# Altium schematic sheet zftplk1.SchDoc
size A4; Organization: ATM PP; SheetNumber: 1; SheetTotal: 1; LotOfPieces: 1
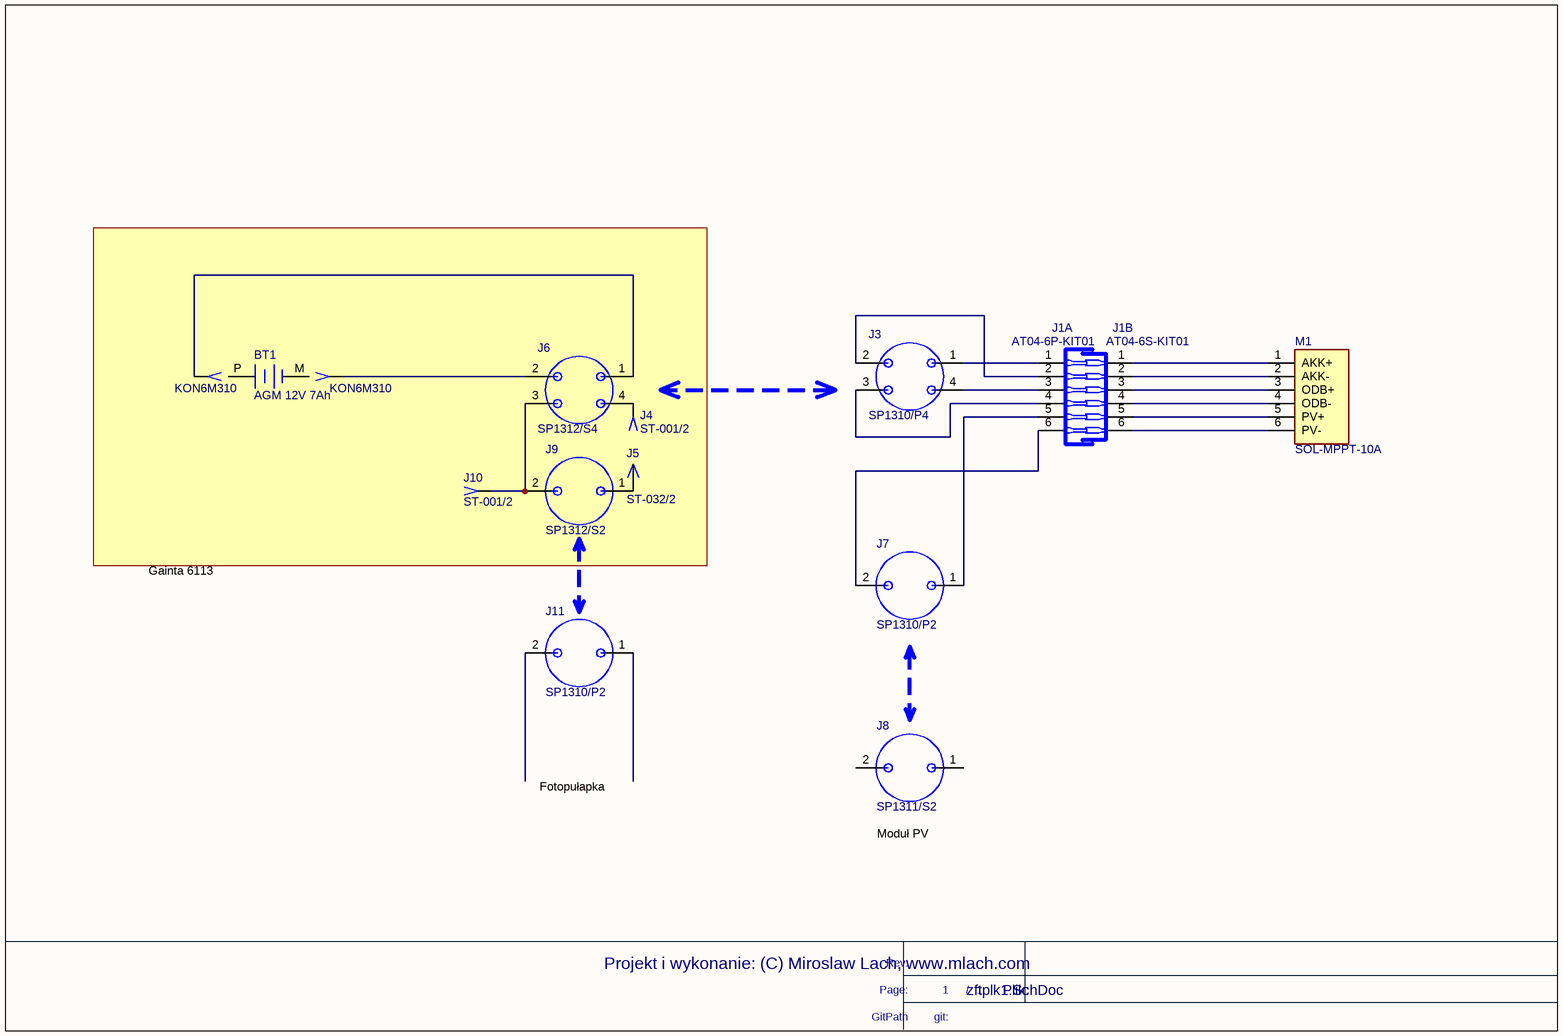
[diagram p0: zftplk1.SchDoc]

## Parts
BT1  AGM 12V 7Ah  [-]
J1  KON6M310
J1A  AT04-6P-KIT01
J1B  AT04-6S-KIT01
J2  KON6M310
J3  SP1310/P4
J4  ST-001/2
J5  ST-032/2
J6  SP1312/S4
J7  SP1310/P2
J8  SP1311/S2
J9  SP1312/S2
J10  ST-001/2
J11  SP1310/P2
M1  SOL-MPPT-10A  [SOL-MPPT-10A]

## Nets
NetJ1_1: J1.1 J6.1
NetJ1A_1: J1A.1 J3.1
NetJ1A_2: J1A.2 J3.2
NetJ1A_3: J1A.3 J3.4
NetJ1A_4: J1A.4 J3.3
NetJ1A_5: J1A.5 J7.1
NetJ1A_6: J1A.6 J7.2
NetJ1B_1: J1B.1 M1.1(AKK+)
NetJ1B_2: J1B.2 M1.2(AKK-)
NetJ1B_3: J1B.3 M1.3(ODB+)
NetJ1B_4: J1B.4 M1.4(ODB-)
NetJ1B_5: J1B.5 M1.5(PV+)
NetJ1B_6: J1B.6 M1.6(PV-)
NetJ2_1: J2.1 J6.2
NetJ4_1: J4.1 J6.4
NetJ5_1: J5.1 J9.1
NetJ6_3: J6.3 J9.2 J10.1

Not connected (* = marked no-connect by the designer): BT1 M(MINU) P(PLUS); J8 1 2; J11 1 2

## Notes on the sheet
- Gainta 6113
- Fotopułapka
- Moduł PV
- Page:
- Rev.
- /
- Projekt i wykonanie: (C) Miroslaw Lach, www.mlach.com
- Plik:
- GitPath
- git:

## Library data of the parts
BT1 = Oth20: Kod: Oth20; ID: 20; Descript: Akumulator Green Cell 12 V 7,2 Ah; Reference: bd; Value: AGM 12V 7Ah; Comm: AGM 12V 7Ah; Price: 55; DateOfPrice: 06-07-2023; Supplier: bd; Manufacturer: bd; Typ: bd
J1 J2 = Con68: Kod: Con68; ID: 68; Descript: Konektor żeński, 6.3 x 0.5 mm, mosiężny, do przewodów 0.5-1.5mm; Replacement: bd; Value: KON6M310; Comm: KON6M310; Price: 0; DateOfPrice: 01-01-2010; Supplier: maritex.com.pl; Reference: KON6M310
J1A = CON350: Manufacturer: Amphenol; Kod: CON350; ID: 350; Descript: Złącze: przewód-przewód; AT; męskie; wtyk; na przewód; PIN: 6; 13A; Replacement: bd; Value: AT04-6P-KIT01; Comm: AT04-6P-KIT01; Price: 21; DateOfPrice: 15-02-2023; Typ: AT04-6P-KIT01; Supplier: TME; Reference: AT04-6P-KIT01
J1B = CON351: Manufacturer: Amphenol; Kod: CON351; ID: 351; Descript: Złącze: przewód-przewód; AT; żeńskie; wtyk; na przewód; PIN: 6; 13A; Replacement: bd; Value: AT04-6S-KIT01; Comm: AT04-6S-KIT01; Price: 36; DateOfPrice: 15-02-2023; Typ: AT04-6S-KIT01; Supplier: TME; Reference: AT04-6S-KIT01
J3 = Con354: Manufacturer: WEIPU; Kod: Con354; ID: 354; Descript: Wtyk; SP13; męskie; PIN: 4; IP68; 4÷6,5mm; 5A; lutowanie; na przewód; Typ: SP1310/P4IN; Replacement: bd; Value: SP1310/P4; Comm: SP1310/P4; Price: 18; DateOfPrice: 06-07-2023; Supplier: tme; Reference: SP1310/P4
J4 J10 = CON353: Manufacturer: Ninigi; Kod: CON353; ID: 353; Descript: Konektor: płaski; 2,8mm; 0,5mm; żeński; 0,5÷1mm2; zaciskanie; Replacement: bd; Value: ST-001/2; Comm: ST-001/2; Price: 0,3; DateOfPrice: 06-07-2023; Typ: ST-001/2; Supplier: tme; Reference: ST-001/2
J5 = CON352: Manufacturer: Ninigi; Kod: CON352; ID: 352; Descript: Konektor: płaski; 2,8mm; 0,8mm; męski; 0,5÷1mm2; zaciskanie; Replacement: bd; Value: ST-032/2; Comm: ST-032/2; Price: 0,3; DateOfPrice: 06-07-2023; Typ: ST-032/2; Supplier: tme; Reference: ST-032/2
J6 = Con355: Manufacturer: WEIPU; Value: SP1312/S3; Kod: Con355; ID: 355; Descript: Gniazdo; SP13; żeńskie; PIN: 4; IP68; 5A; lutowanie; na panel; 200V; Typ: SP1310/S4; Replacement: bd; Comm: SP1312/S4; Price: 18; DateOfPrice: 16-07-2023; Supplier: tme; Reference: SP1310/S4
J7 J11 = Con356: Manufacturer: WEIPU; Kod: Con356; ID: 356; Descript: Wtyk; SP13; męskie; PIN: 2; IP68; 4÷6,5mm; 13A; lutowanie; na przewód; Typ: SP1310/S4; Replacement: bd; Value: SP1310/P2; Comm: SP1310/P2; Price: 18; DateOfPrice: 16-07-2023; Supplier: tme; Reference: SP1310/S4
J8 = Con358: Manufacturer: WEIPU; Kod: Con358; ID: 358; Descript: Wtyk; SP13; żeńskie; PIN: 2; IP68; 4÷6,5mm; 13A; lutowanie; 250V; 2mm2; Reference: SP1311/P2; Replacement: bd; Value: SP1311/S2; Comm: SP1311/S2; Price: 18; DateOfPrice: 16-07-2023; Typ: SP1311/S2; Supplier: tme
J9 = Con357: Manufacturer: WEIPU; Kod: Con357; ID: 357; Descript: Gniazdo; SP13; żeńskie; PIN: 2; IP68; 13A; lutowanie; na panel; 250V; Replacement: bd; Value: SP1312/S2; Comm: SP1312/S2; Price: 18; DateOfPrice: 16-07-2023; Typ: SP1312/S2; Supplier: tme; Reference: SP1312/S2
M1 = Mod107: Manufacturer: Volt Polska; Kod: Mod107; ID: 107; Descript: Regulator solarny MPPT, 10A,; Reference: bd; Value: SOL-MPPT-10A; Comm: SOL-MPPT-10A; Price: 150; DateOfPrice: 19-02-2023; Supplier: bd; Typ: SOL-MPPT-10A